# EAGLE design shield (EAGLE 9.1.0)
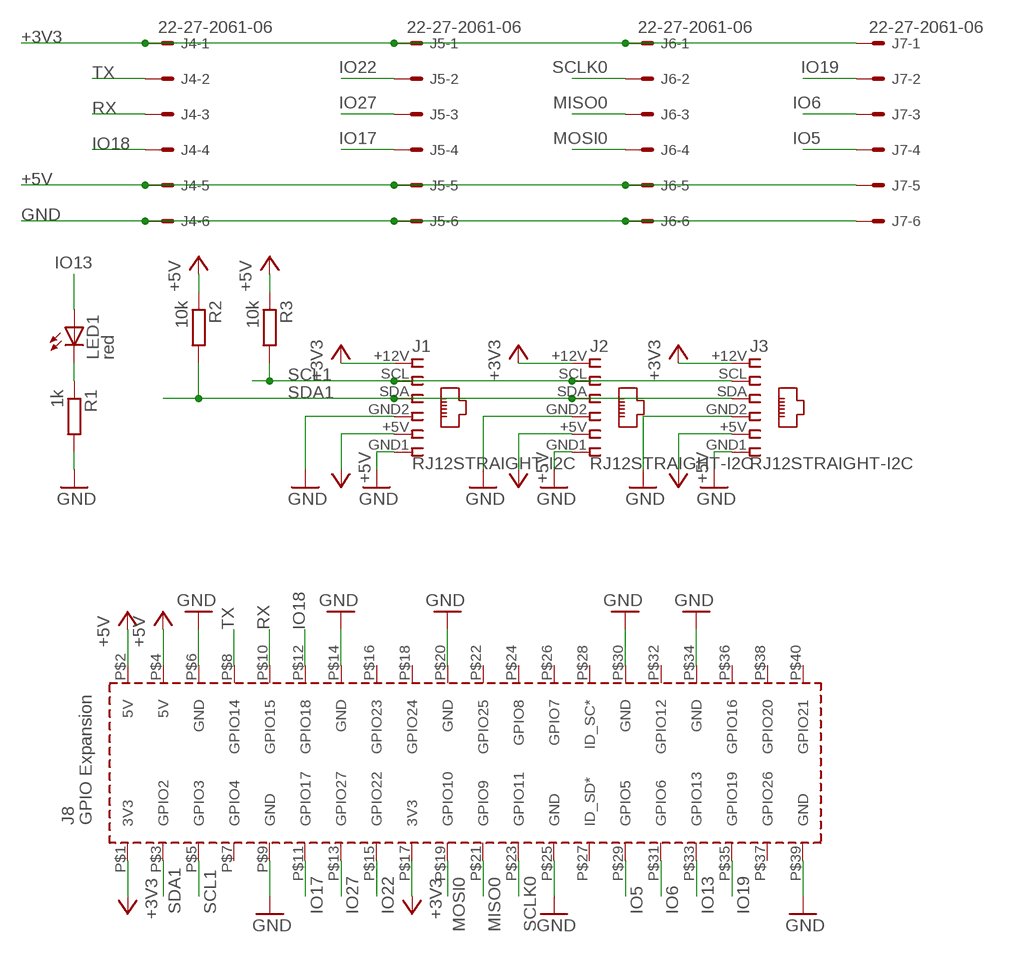
[diagram p0: schematic, sheet 1]

## Parts
J1  RJ12STRAIGHT-I2C  [RJ12-STRAIGHT-I2C]
J2  RJ12STRAIGHT-I2C  [RJ12-STRAIGHT-I2C]
J3  RJ12STRAIGHT-I2C  [RJ12-STRAIGHT-I2C]
J4  22-27-2061-06  [6410-06]
J5  22-27-2061-06  [6410-06]
J6  22-27-2061-06  [6410-06]
J7  22-27-2061-06  [6410-06]
LED1  red  LEDSML0805  [SML0805]
PCB1  RPI3RPI3MIRROR  [RPI3MIRROR]
R1  1k  R-EU_R0805  [R0805]
R2  10k  R-EU_R0805  [R0805]
R3  10k  R-EU_R0805  [R0805]

## Nets
+3V3: J1.+12V J2.+12V J3.+12V J4.1 J5.1 J6.1 J7.1 PCB1.P$1(3V3) PCB1.P$17(3V3)
+5V: J1.+5V J2.+5V J3.+5V J4.5 J5.5 J6.5 J7.5 PCB1.P$2(5V) PCB1.P$4(5V) R2.1 R3.1
GND: J1.GND1 J1.GND2 J2.GND1 J2.GND2 J3.GND1 J3.GND2 J4.6 J5.6 J6.6 J7.6 PCB1.P$6(GND) PCB1.P$9(GND) PCB1.P$14(GND) PCB1.P$20(GND) PCB1.P$25(GND) PCB1.P$30(GND) PCB1.P$34(GND) PCB1.P$39(GND) R1.2
IO5: J7.4 PCB1.P$29(GPIO5)
IO6: J7.3 PCB1.P$31(GPIO6)
IO13: LED1.A PCB1.P$33(GPIO13)
IO17: J5.4 PCB1.P$11(GPIO17)
IO18: J4.4 PCB1.P$12(GPIO18)
IO19: J7.2 PCB1.P$35(GPIO19)
IO22: J5.2 PCB1.P$15(GPIO22)
IO27: J5.3 PCB1.P$13(GPIO27)
MISO0: J6.3 PCB1.P$21(GPIO9)
MOSI0: J6.4 PCB1.P$19(GPIO10)
N$2: LED1.C R1.1
RX: J4.3 PCB1.P$10(GPIO15)
SCL1: J1.SCL J2.SCL J3.SCL PCB1.P$5(GPIO3) R3.2
SCLK0: J6.2 PCB1.P$23(GPIO11)
SDA1: J1.SDA J2.SDA J3.SDA PCB1.P$3(GPIO2) R2.2
TX: J4.2 PCB1.P$8(GPIO14)
Unconnected: PCB1.P$7(GPIO4) PCB1.P$16(GPIO23) PCB1.P$18(GPIO24) PCB1.P$22(GPIO25) PCB1.P$24(GPIO8) PCB1.P$26(GPIO7) PCB1.P$27(ID_SD*) PCB1.P$28(ID_SC*) PCB1.P$32(GPIO12) PCB1.P$36(GPIO16) PCB1.P$37(GPIO26) PCB1.P$38(GPIO20) PCB1.P$40(GPIO21)

## Library data of the parts
J1-J3 = lpatiny:RJ12: CORCOM Modular RJ Jacks No Shield Source: www.tycoelectronics.com .. ENG_DS_1654001_1099_RJ_L_0507.pdf
J4-J7 = con-molex:22-?-06: CONNECTOR wire to board 2.54 mm (.1 inch) pitch header; MF: MOLEX; OC_FARNELL: unknown; OC_NEWARK: unknown
LED1 = led:LED: LED OSRAM: - CHIPLED LG R971, LG N971, LY N971, LG Q971, LY Q971, LO R971, LY R971 LH N974, LH R974 LS Q976, LO Q976, LY Q976 LO Q996 - Hyper CHIPLED LW Q18S LB Q993, LB Q99A, LB R99A - SideLED LS A670, LO A670, LY A670, LG A670, LP A670 LB A673, LV A673, LT A673, LW A673 LH A674 LY A675 LS A676, LA A676, LO A676, LY A676, LW A676 LS A679, LY A679, LG A679 - Hyper Micro SIDELED® LS Y876, LA Y876, LO Y876, LY Y876 LT Y87S - SmartLED LW L88C, LW L88S LB L89C, LB L89S, LG L890 LS L89K, LO L89K, LY L89K LS L896, LA L896, LO L896, LY L896 - TOPLED LS T670, LO T670, LY T670, LG T670, LP T670 LSG T670, LSP T670, LSY T670, LOP T670, LYG T670 LG T671, LOG T671, LSG T671 LB T673, LV T673, LT T673, LW T673 LH T674 LS T676, LA T676, LO T676, LY T676, LB T676, LH T676, LSB T676, LW T676 LB T67C, LV T67C, LT T67C, LS T67K, LO T67K, LY T67K, LW E67C LS E67B, LA E67B, LO E67B, LY E67B, LB E67C, LV E67C, LT E67C LW T67C LS T679, LY T679, LG T679 LS T770, LO T770, LY T770, LG T770, LP T770 LB T773, LV T773, LT T773, LW T773 LH T774 LS E675, LA E675, LY E675, LS T675 LS T776, LA T776, LO T776, LY T776, LB T776 LHGB T686 LT T68C, LB T68C - Hyper Mini TOPLED® LB M676 - Mini TOPLED Santana® LG M470 LS M47K, LO M47K, LY M47K Source: http://www.osram.convergy.de LUXEON: - LUMILED® LXK2-PW12-R00, LXK2-PW12-S00, LXK2-PW14-U00, LXK2-PW14-V00 LXK2-PM12-R00, LXK2-PM12-S00, LXK2-PM14-U00 LXK2-PE12-Q00, LXK2-PE12-R00, LXK2-PE12-S00, LXK2-PE14-T00, LXK2-PE14-U00 LXK2-PB12-K00, LXK2-PB12-L00, LXK2-PB12-M00, LXK2-PB14-N00, LXK2-PB14-P00, LXK2-PB14-Q00 LXK2-PR12-L00, LXK2-PR12-M00, LXK2-PR14-Q00, LXK2-PR14-R00 LXK2-PD12-Q00, LXK2-PD12-R00, LXK2-PD12-S00 LXK2-PH12-R00, LXK2-PH12-S00 LXK2-PL12-P00, LXK2-PL12-Q00, LXK2-PL12-R00 Source: www.luxeon.com KINGBRIGHT: KA-3528ASYC Source: www.kingbright.com
PCB1 = e14_Rpi3_RevA+mirror-pcb:RPI3: Device for Raspberry Pi 3 board created by Dave Young for www.element14.com More information and support community is available at https://www.element14.com/community/community/raspberry-pi Device for Raspberry Pi 3 board updated by Gerald Schwarz for www.element14.com On RPI3 addet the layer milling and created a mirrored shield.
R1-R3 = rcl:R-EU_: RESISTOR, European symbol; SPICEPREFIX: R

## Net classes
1 power: width 0.203 mm, drill 0.305 mm, clearance 0.25 mm

## Board
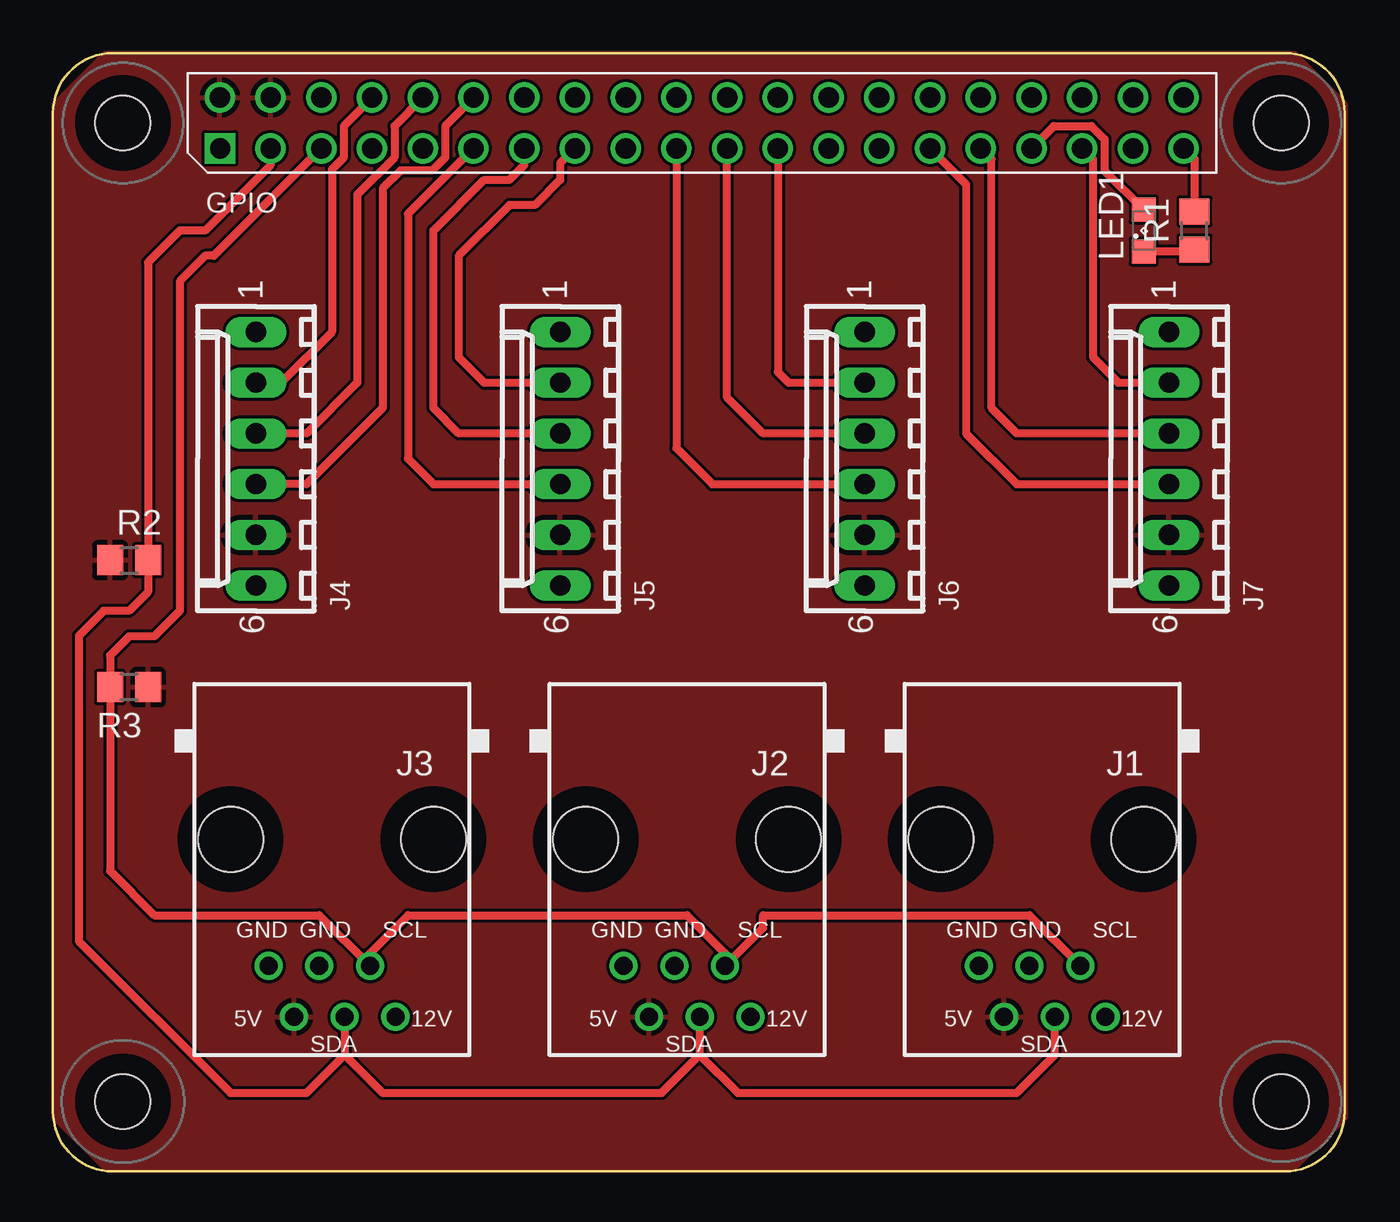
[diagram p1: board, top side]
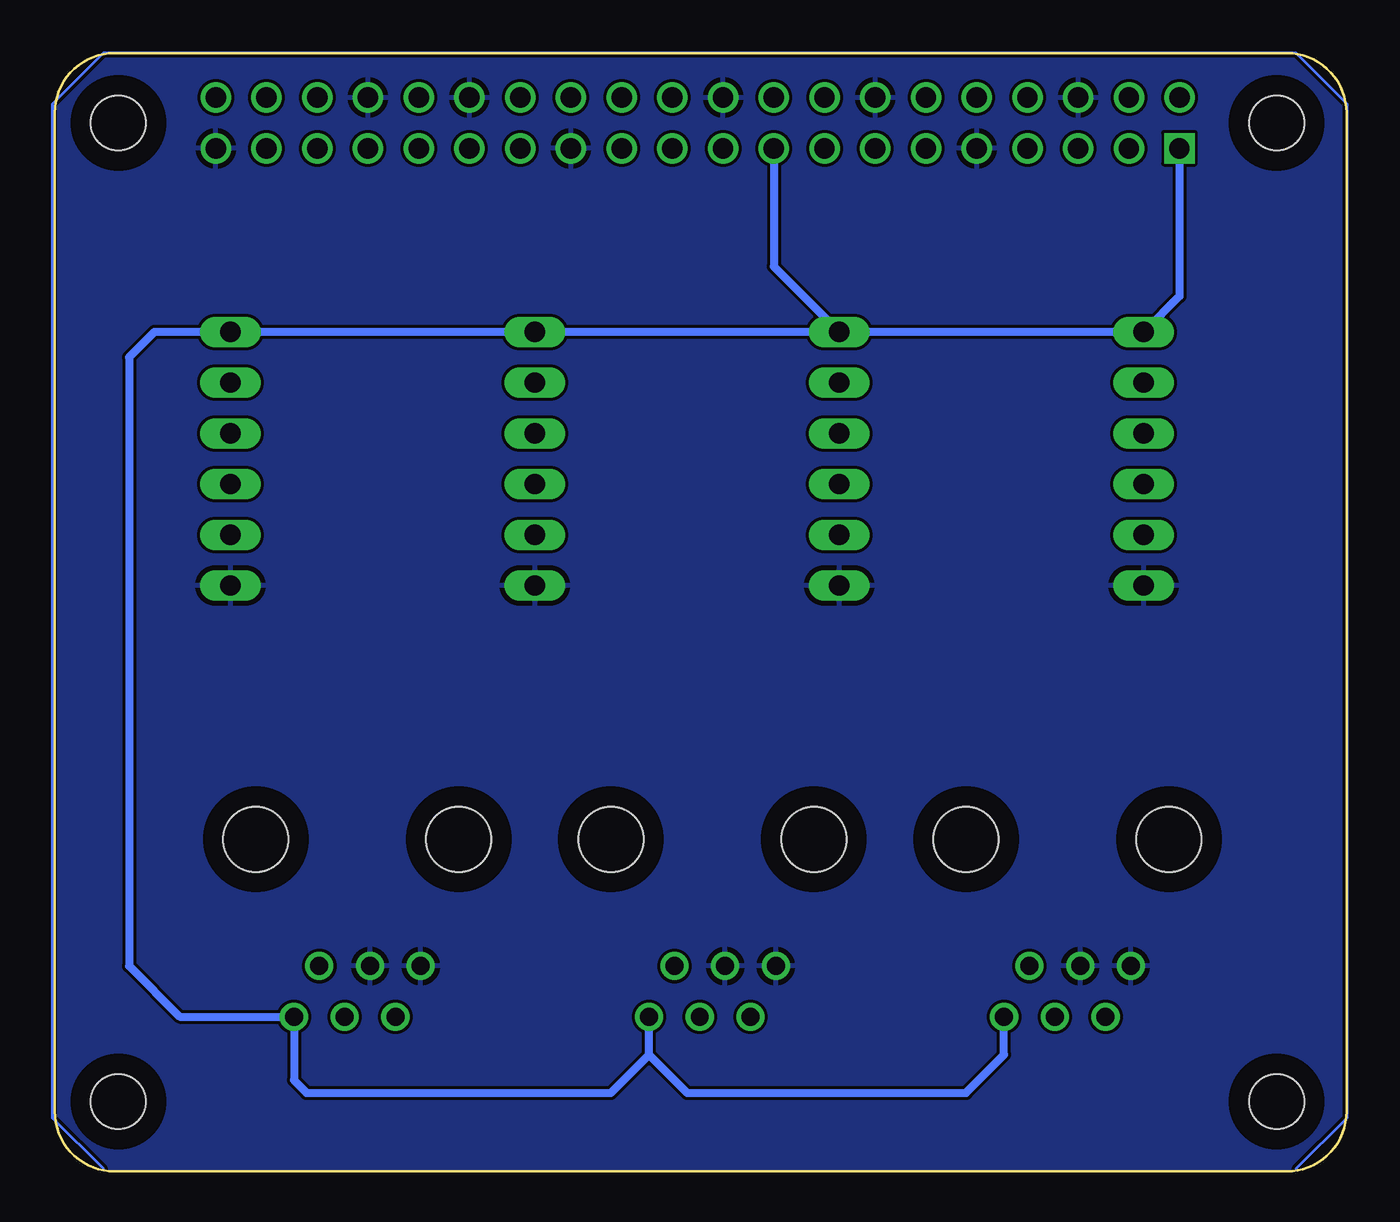
[diagram p2: board, bottom side, seen from below]

No outline drawn. Coordinates in mm, seen from the top.
Copper layers (1*16): Top 0.035mm / dielectric 1.5mm / Bottom 0.035mm
Design rules "default": minimum track width 6mil, minimum drill 0.35mm, track to track 6mil, track to pad 6mil, pad to pad 6mil, via to via 6mil, smd to smd 6mil, copper to edge 40mil, drill to drill 6mil, minimum pad ring 10mil, minimum via ring 8mil, stop-mask expansion 4mil, vias tented up to drill 0mil, thermal gap 10mil

### Footprints (pad centres in the part's own frame; a part is rotated, then mirrored left to right if it is on the bottom)
RJ12-STRAIGHT-I2C = drill 0.9 pad 1.4: +5V 1.905,8.89; +12V -3.175,8.89; GND1 3.175,6.35; GND2 0.635,6.35; SCL -1.905,6.35; SDA -0.635,8.89 | hole 3.251: -5.08,0; 5.08,0
6410-06 = drill 1.016 long: 1 6.35,0; 2 3.81,0; 3 1.27,0; 4 -1.27,0; 5 -3.81,0; 6 -6.35,0
SML0805 = smd 1.2 x 1.2: A 1.05,0; C -1.05,0
RPI3MIRROR = drill 1.016 square: P$1 8.37,4.775 | drill 1.016: P$2 8.357,2.233; P$3 10.897,4.773; P$4 10.897,2.233; P$5 13.437,4.773; P$6 13.437,2.233; P$7 15.977,4.773; P$8 15.977,2.233; P$9 18.517,4.773; P$10 18.517,2.233; P$11 21.057,4.773; P$12 21.057,2.233; P$13 23.597,4.773; P$14 23.597,2.233; P$15 26.137,4.773; P$16 26.137,2.233; P$17 28.677,4.773; P$18 28.677,2.233; P$19 31.217,4.773; P$20 31.217,2.233; P$21 33.757,4.773; P$22 33.757,2.233; P$23 36.297,4.773; P$24 36.297,2.233; P$25 38.837,4.773; P$26 38.837,2.233; P$27 41.377,4.773; P$28 41.377,2.233; P$29 43.917,4.773; P$30 43.917,2.233; P$31 46.457,4.773; P$32 46.457,2.233; P$33 48.997,4.773; P$34 48.997,2.233; P$35 51.537,4.773; P$36 51.537,2.233; P$37 54.077,4.773; P$38 54.077,2.233; P$39 56.617,4.773; P$40 56.617,2.233 | hole 2.75: 3.5,52.505; 61.5,52.505; 3.5,3.505; 61.5,3.505
R0805 = smd 1.3 x 1.5: 1 -0.95,0; 2 0.95,0

### Placement (x,y rotation side)
J1  50.8,17.78 180 top
J2  33.02,17.78 180 top
J3  15.24,17.78 180 top
J4  11.43,36.83 90 top
J5  26.67,36.83 90 top
J6  41.91,36.83 90 top
J7  57.15,36.83 90 top
LED1  55.88,48.26 90 top
PCB1  1.27,57.15 180 bottom
R1  58.42,48.26 90 top
R2  5.08,31.75 0 top
R3  5.08,25.4 180 top

### Tracks (layer width: path | path; a pad name or v marks a point on that pad's centre or on a via)
+3V3
  Bottom 0.406: J5.1 J4.1 9.64,44.97 PCB1.P$1 | J5.1 J6.1 J7.1 60.96,43.18 62.23,41.91 62.23,11.43 59.69,8.89 J1.+12V 53.98,5.71 53.34,5.08 38.1,5.08 36.2,6.99 | PCB1.P$17 29.95,46.46 J5.1 | 36.2,6.99 J2.+12V | 36.2,6.99 34.29,5.08 20.32,5.08 18.41,6.99 J3.+12V
+5V
  pour Top: 3.81,57.15 1.27,54.61 1.27,3.81 3.81,1.27 63.5,1.27 66.04,3.81 66.04,54.61 63.5,57.15
GND
  Top 0.406: PCB1.P$39 58.42,51.84 R1.2
  pour Bottom: 3.81,57.15 1.27,54.61 1.27,3.81 3.81,1.27 63.5,1.27 66.04,3.81 66.04,54.61 63.5,57.15
IO5
  Top 0.406: PCB1.P$29 46.99,50.57 46.99,38.1 49.53,35.56 J7.4
IO6
  Top 0.406: J7.3 49.53,38.1 48.26,39.37 48.26,51.84 PCB1.P$31
IO13
  Top 0.406: PCB1.P$33 51.38,53.49 53.27,53.49 53.92,52.84 53.92,51.27 LED1.A
IO17
  Top 0.406: PCB1.P$11 19.05,49.1 19.05,36.83 20.32,35.56 J5.4
IO18
  Top 0.406: PCB1.P$12 20.9,53.49 20.9,51.91 20.25,51.26 18.67,51.26 17.78,50.37 17.78,39.37 13.97,35.56 J4.4
IO19
  Top 0.406: PCB1.P$35 53.34,51.84 53.34,41.91 54.61,40.64 J7.2
IO22
  Top 0.406: PCB1.P$15 26.67,51.64 26.67,50.8 25.4,49.53 24.13,49.53 21.59,46.99 21.59,41.91 22.86,40.64 J5.2
IO27
  Top 0.406: J5.3 21.59,38.1 20.32,39.37 20.32,48.26 22.86,50.8 24.13,50.8 24.87,51.54 PCB1.P$13
MISO0
  Top 0.406: J6.3 36.83,38.1 35.03,39.9 PCB1.P$21
MOSI0
  Top 0.406: PCB1.P$19 32.49,37.36 34.29,35.56 J6.4
N$1
  Bottom 0.152: 1.27,54.61 1.27,3.81 | 1.27,3.81 3.81,1.27 1.27,3.81 | 66.04,3.81 63.5,1.27 66.04,3.81 | 66.04,3.81 66.04,54.61 | 66.04,54.61 63.5,57.15 | 63.5,57.15 3.81,57.15 | 3.81,57.15 1.27,54.61 | 1.27,54.61 1.27,3.81 | 66.04,3.81 66.04,54.61 | 66.04,54.61 63.5,57.15 | 63.5,57.15 3.81,57.15 | 3.81,57.15 1.27,54.61
N$2
  Top 0.406: R1.1 58.32,47.21 LED1.C
RX
  Top 0.406: PCB1.P$10 18.36,53.49 18.36,51.91 16.51,50.06 16.51,40.64 13.97,38.1 J4.3
SCL1
  Top 0.406: PCB1.P$5 9.32,46.99 8.89,46.99 7.62,45.72 7.62,29.21 6.35,27.94 5.08,27.94 4.13,26.99 R3.2 4.13,16.19 6.35,13.97 14.61,13.97 J3.SCL 17.14,12.06 19.05,13.97 33.02,13.97 34.92,12.06 J2.SCL 36.83,13.34 36.83,13.97 50.16,13.97 J1.SCL
SCLK0
  Top 0.406: PCB1.P$23 37.57,41.17 38.1,40.64 J6.2
SDA1
  Top 0.406: PCB1.P$3 12.17,51.54 8.89,48.26 7.62,48.26 6.03,46.67 R2.2 6.03,30.16 5.08,29.21 3.81,29.21 2.56,27.96 2.56,12.68 10.16,5.08 13.97,5.08 15.88,6.99 | J3.SDA 15.88,6.99 | 15.88,6.99 17.78,5.08 31.75,5.08 33.66,6.99 | J2.SDA 33.66,7.62 | 33.66,7.62 33.66,6.99 | 33.66,7.62 33.66,6.99 | 33.66,6.99 35.56,5.08 49.53,5.08 51.44,6.99 J1.SDA
TX
  Top 0.406: PCB1.P$8 15.82,53.49 15.82,51.91 15.24,51.33 15.24,43.18 12.7,40.64 J4.2

### Text on the board
tDocu: Legoino RPi shied v1.0.0 | RX | 22 | SCLK | 19 | TX | 27 | MISO | 6 | 18 | 17 | MOSI | 5
bDocu: Legoino RPi shied v1.0.0